# EAGLE schematic lightmeter_proto3 (EAGLE 7.1.0)
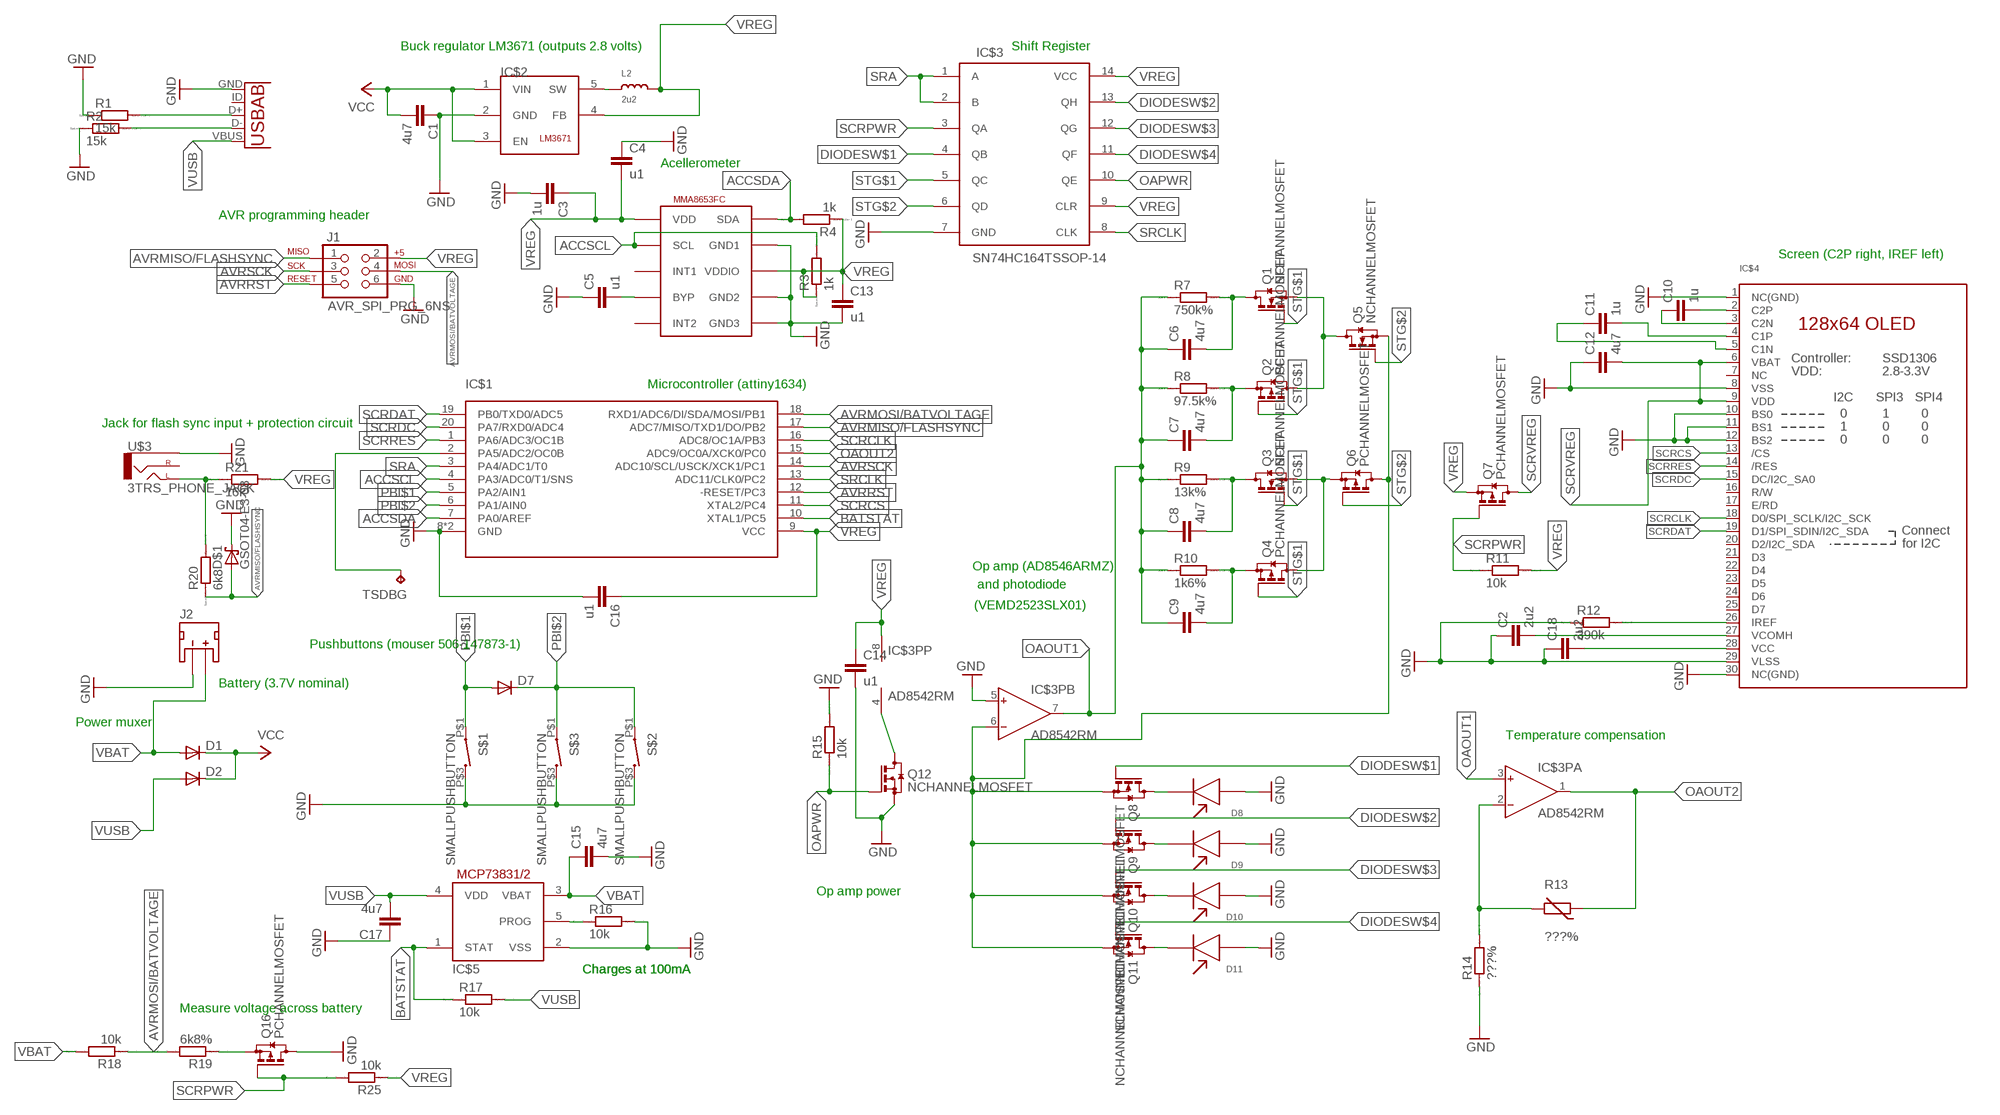
[diagram p0: schematic, sheet 1]

## Parts
C1  4u7  C-EUC0402  [C0402]
C2  2u2  C-EUC0402  [C0402]
C3  1u  C-EUC0402  [C0402]
C4  u1  C-EUC0402  [C0402]
C5  u1  C-EUC0402  [C0402]
C6  4u7  C-EUC0402  [C0402]
C7  4u7  C-EUC0402  [C0402]
C8  4u7  C-EUC0402  [C0402]
C9  4u7  C-EUC0402  [C0402]
C10  1u  C-EUC0402  [C0402]
C11  1u  C-EUC0402  [C0402]
C12  4u7  C-EUC0402  [C0402]
C13  u1  C-EUC0402  [C0402]
C14  u1  C-EUC0402  [C0402]
C15  4u7  C-EUC0402  [C0402]
C16  u1  C-EUC0402  [C0402]
C17  4u7  C-EUC0402  [C0402]
C18  2u2  C-EUC0402  [C0402]
D1  DIODE-SOD323-W  [SOD323-W]
D2  DIODE-SOD323-W  [SOD323-W]
D7  DIODE-SOD323-W  [SOD323-W]
D8  VEMD2523SLX01  [VEMD2523SLX01]
D9  VEMD2523SLX01  [VEMD2523SLX01]
D10  VEMD2523SLX01  [VEMD2523SLX01]
D11  VEMD2523SLX01  [VEMD2523SLX01]
D$1  GSOT04-E3-08  [SOT23]
IC$1  ATTINY1634MLF20  [MLF20]
IC$2  LM3671  [SOT23-5]
IC$3  SN74HC164TSSOP-14  [TSSOP14]
IC$3P  AD8542RM  [MSOP08]
IC$4  DISP_OLED_UG-2864HSWEG010.96"  [UG-2864HSWEG01_0.96IN_WRAPAROUND]
IC$5  MCP73831/OT  [SOT23-5L]
IC$6  MMA8653  [DFN-10]
J1  AVR_SPI_PRG_6NS  [2X3-NS]
J2  JST_2MM_MALE  [JST-2-SMD]
L2  2u2  INDUCTOR_0603  [_0603]
Q1  NCHANNELMOSFET  [SOT-416-3]
Q2  PCHANNELMOSFET  [SOT-416-3]
Q3  NCHANNELMOSFET  [SOT-416-3]
Q4  PCHANNELMOSFET  [SOT-416-3]
Q5  NCHANNELMOSFET  [SOT-416-3]
Q6  PCHANNELMOSFET  [SOT-416-3]
Q7  PCHANNELMOSFET  [SOT-416-3]
Q8  NCHANNELMOSFET  [SOT-416-3]
Q9  NCHANNELMOSFET  [SOT-416-3]
Q10  NCHANNELMOSFET  [SOT-416-3]
Q11  NCHANNELMOSFET  [SOT-416-3]
Q12  NCHANNELMOSFET  [SOT-416-3]
Q16  PCHANNELMOSFET  [SOT-416-3]
R1  15k  R-EU_R0402  [R0402]
R2  15k  R-EU_R0402  [R0402]
R3  1k  R-EU_R0402  [R0402]
R4  1k  R-EU_R0402  [R0402]
R7  750k%  R-EU_R0402  [R0402]
R8  97.5k%  R-EU_R0402  [R0402]
R9  13k%  R-EU_R0402  [R0402]
R10  1k6%  R-EU_R0402  [R0402]
R11  10k  R-EU_R0402  [R0402]
R12  390k  R-EU_R0402  [R0402]
R13  ???%  THERMISTORR0402  [R0402]
R14  ???%  R-EU_R0402  [R0402]
R15  10k  R-EU_R0402  [R0402]
R16  10k  R-EU_R0402  [R0402]
R17  10k  R-EU_R0402  [R0402]
R18  10k  R-EU_R0402  [R0402]
R19  6k8%  R-EU_R0402  [R0402]
R20  6k8  R-EU_R0402  [R0402]
R21  16k  R-EU_R0402  [R0402]
R25  10k  R-EU_R0402  [R0402]
S$1  SMALLPUSHBUTTON  [BUTTON]
S$2  SMALLPUSHBUTTON  [BUTTON]
S$3  SMALLPUSHBUTTON  [BUTTON]
TSDBG  TPPAD1-13  [P1-13]
U1  USB-AB  [USB-AB-MICRO]
U$3  3TRS_PHONE_JACK  [3TRS-SMD]

## Nets
ACCSCL: IC$1.4(PA3/ADC0/T1/SNS) IC$6.P$2(SCL) R3.2
ACCSDA: IC$1.7(PA0/AREF) IC$6.P$10(SDA) R4.2
AVRMISO/FLASHSYNC: D$1.1(A) IC$1.17(ADC7/MISO/TXD1/DO/PB2) J1.1 R20.1
AVRMOSI/BATVOLTAGE: IC$1.18(RXD1/ADC6/DI/SDA/MOSI/PB1) J1.4 R18.1 R19.2
AVRRST: IC$1.12(-RESET/PC3) J1.5
AVRSCK: IC$1.14(ADC10/SCL/USCK/XCK1/PC1) J1.3
BATSTAT: IC$1.10(XTAL1/PC5) IC$5.1(STAT) R17.1
DIODESW$1: IC$3.4(QB) Q8.P$1(G)
DIODESW$2: IC$3.13(QH) Q9.P$1(G)
DIODESW$3: IC$3.12(QG) Q10.P$1(G)
DIODESW$4: IC$3.11(QF) Q11.P$1(G)
GND: C1.1 C2.1 C3.2 C4.1 C5.1 C12.1 C13.2 C14.2 C15.2 C16.2 C17.1 C18.1 D8.P$1 D9.P$1 D10.P$1 D11.P$1 D$1.3(C) IC$1.8(GND) IC$1.GND IC$2.2(GND) IC$3.7(GND) IC$3P.5(B:IN+) IC$4.1(NC(GND)) IC$4.8(VSS) IC$4.10(BS0) IC$4.11(BS1) IC$4.12(BS2) IC$4.29(VLSS) IC$4.30(NC(GND)) IC$5.2(VSS) IC$6.P$6(GND3) IC$6.P$7(GND2) IC$6.P$9(GND1) J1.6 J2.1(-) Q12.P$2(S) Q16.P$3(D) R1.1 R2.1 R12.1 R14.1 R15.2 R16.2 S$1.P$3 S$2.P$3 S$3.P$3 U1.GND U$3.P$1(SLEEVE)
N$1: D8.P$2 Q8.P$3(D)
N$2: D9.P$2 Q9.P$3(D)
N$3: C7.2 Q2.P$2(S) R8.2
N$4: C9.2 Q4.P$2(S) R10.2
N$5: IC$5.5(PROG) R16.1
N$6: IC$3P.4(P:V-) Q12.P$3(D)
N$7: C5.2 IC$6.P$4(BYP)
N$9: D10.P$2 Q10.P$3(D)
N$10: IC$2.5(SW) L2.1
N$11: D11.P$2 Q11.P$3(D)
N$12: C2.2 IC$4.27(VCOMH)
N$14: C8.2 Q3.P$3(D) R9.2
N$15: C10.2 IC$4.2(C2P)
N$16: C10.1 IC$4.3(C2N)
N$17: Q16.P$2(S) R19.1
N$19: IC$4.26(IREF) R12.2
N$20: Q1.P$2(S) Q2.P$3(D) Q5.P$3(D)
N$21: C6.2 Q1.P$3(D) R7.2
N$22: Q3.P$2(S) Q4.P$3(D) Q6.P$2(S)
N$23: IC$1.2(PA5/ADC2/OC0B) TSDBG.TP
N$24: C11.1 IC$4.5(C1N)
N$26: IC$3P.6(B:IN-) Q5.P$2(S) Q6.P$3(D) Q8.P$2(S) Q9.P$2(S) Q10.P$2(S) Q11.P$2(S)
N$27: C11.2 IC$4.4(C1P)
N$28: R1.2 U1.D+
N$29: R20.2 R21.1 U$3.P$3(LEFT)
N$30: C18.2 IC$4.28(VCC)
N$31: IC$3P.2(A:IN-) R13.2 R14.2
N$32: R2.2 U1.D-
OAOUT1: C6.1 C7.1 C8.1 C9.1 IC$3P.3(A:IN+) IC$3P.7(B:OUT) R7.1 R8.1 R9.1 R10.1
OAOUT2: IC$1.15(ADC9/OC0A/XCK0/PC0) IC$3P.1(A:OUT) R13.1
OAPWR: IC$3.10(QE) Q12.P$1(G) R15.1
PBI$1: D7.A IC$1.5(PA2/AIN1) S$1.P$1
PBI$2: D7.C IC$1.6(PA1/AIN0) S$2.P$1 S$3.P$1
SCRCLK: IC$1.16(ADC8/OC1A/PB3) IC$4.18(D0/SPI_SCLK/I2C_SCK)
SCRCS: IC$1.11(XTAL2/PC4) IC$4.13(/CS)
SCRDAT: IC$1.19(PB0/TXD0/ADC5) IC$4.19(D1/SPI_SDIN/I2C_SDA)
SCRDC: IC$1.20(PA7/RXD0/ADC4) IC$4.15(DC/I2C_SA0)
SCRPWR: IC$3.3(QA) Q7.P$1(G) Q16.P$1(G) R11.1 R25.2
SCRRES: IC$1.1(PA6/ADC3/OC1B) IC$4.14(/RES)
SCRVREG: C12.2 IC$4.6(VBAT) IC$4.9(VDD) Q7.P$3(D)
SRA: IC$1.3(PA4/ADC1/T0) IC$3.1(A) IC$3.2(B)
SRCLK: IC$1.13(ADC11/CLK0/PC2) IC$3.8(CLK)
STG$1: IC$3.5(QC) Q1.P$1(G) Q2.P$1(G) Q3.P$1(G) Q4.P$1(G)
STG$2: IC$3.6(QD) Q5.P$1(G) Q6.P$1(G)
VBAT: C15.1 D1.A IC$5.3(VBAT) J2.2(+) R18.2
VCC: C1.2 D1.C D2.C IC$2.1(VIN) IC$2.3(EN)
VREG: C3.1 C4.2 C13.1 C14.1 C16.1 IC$1.9(VCC) IC$2.4(FB) IC$3.9(CLR) IC$3.14(VCC) IC$3P.8(P:V+) IC$6.P$1(VDD) IC$6.P$8(VDDIO) J1.2 L2.2 Q7.P$2(S) R3.1 R4.1 R11.2 R21.2 R25.1
VUSB: C17.2 D2.A IC$5.4(VDD) R17.2 U1.VBUS
Unconnected: IC$4.7(NC) IC$4.16(R/W) IC$4.17(E/RD) IC$4.20(D2/I2C_SDA) IC$4.21(D3) IC$4.22(D4) IC$4.23(D5) IC$4.24(D6) IC$4.25(D7) IC$6.P$3(INT1) IC$6.P$5(INT2) J2.NC1(PAD1) J2.NC2(PAD2) U1.ID(USBID) U$3.P$2(RIGHT)

## Notes on the sheet
- Buck regulator LM3671 (outputs 2.8 volts) | Shift Register
- Acellerometer
- AVR programming header
- Screen (C2P right, IREF left)
- Microcontroller (attiny1634)
- Jack for flash sync input + protection circuit
- Op amp (AD8546ARMZ)
- and photodiode
- (VEMD2523SLX01)
- Pushbuttons (mouser 506-147873-1)
- Battery (3.7V nominal)
- Power muxer
- Temperature compensation
- Op amp power
- Charges at 100mA | Charges at 100mA
- Measure voltage across battery

## Library data of the parts
C1-C18 = rcl:C-EU: CAPACITOR, European symbol
D1 D2 D7 = diode2:DIODE-: DIODE
D8-D11 = lightmeter:VEMD2523SLX01
D$1 = lightmeter:GSOT04-E3-08
IC$1 = attiny1634_corrected:ATTINY1634
IC$2 = lightmeter:LM3671
IC$3 = lightmeter:SN74HC164
IC$3P = analog-devices:AD8542: General-Purpose CMOS Rail-to-Rail Amplifiers Source: http://www.analog.com/static/imported-files/data_sheets/AD8541_8542_8544.pdf; MPN: AD8542ARZ; OC_FARNELL: 1464965; OC_NEWARK: 19M0965
IC$4 = microbuilder:DISP_OLED_UG-2864HSWEG01: UG-2864HSWEG01 OLED display Both 1.3" and 0.96" models share the same FPC tab footprint, only the screen dimensions vary.
IC$5 = adafruit:MCP73831: MCP73831/2 Miniature Single-Cell, Fully Integrated Li-Ion, Li-Polymer Charge Management Controllers. Nice and small simple lipoly charge controller, with adjustable current and status output (LED) http://www.ladyada.net/library/pcb/eaglelibrary.html
IC$6 = lightmeter:MMA8653
J1 = SparkFun-Connectors:AVR_SPI_PRG_6: AVR ISP 6 Pin This is the reduced ISP connector for AVR programming. Common on Arduino. This footprint will take up less PCB space and can be used with a 10-pin to 6-pin adapter such as SKU: BOB-08508 **Special note about "TEST_POINT" package. The stop mask is on the top side, so if you want your programming test points to be on the bottom of your board, make sure to place this package on the bottom side of the board. This also ensure that the orientation to program from the bottom side will be correct.
J2 = SparkFun-Connectors:JST_2MM_MALE: Mates to single-cell LiPo batteries. CONN-08352; PROD_ID: CONN-08352
L2 = microbuilder:INDUCTOR: Inductors 0603: 10nH Ceramic Inductor - microwire antenna/RF (Digikey: 712-1434-2-ND) 0805: 560nH Ceramic Inductor - RF (Digikey: 553-1047-1-ND) 270nH Ceramic Inductor - Q = 40@250MHz, +-5%, 1 Ohm DC Resistance (Digikey: 535-10506-2-ND) 1007 (2518 Metric) SMT: 10µH 10% 250mOhm 820mA 1007 Inductor (Digikey: 587-2189-1-ND) 22µH 10% 500mOhm 580mA 1007 Inductor (Digikey: 587-2190-1-ND) 47µH 10% 950mOhm 420mA 1007 Inductor (Digikey: 587-2191-1-ND) 47µH 5% 100mOhm 1A 1008 Inductor (Digikey: 732-1816-1-ND) 5.0x5.0mm (Taiyo Yuden NR5040 Series) 6.8µH 20% 2.3A 64mOhm Inductor (Digikey: 587-2374-2-ND) 5.0x5.0mm (TDK VLC5045 Series) 4.7µH 20% 3.3A 34mOhm Inductor (Digikey: 445-6526-1-ND) 6.8µH 20% 2.7A 46mOhm Inductor (Digikey: 445-6527-1-ND) 6.0x6.0mm (TDK VLC6045 Series) 4.7µH 20% 3.8A 27mOhm Inductor (Digikey: 445-6538-2-ND) 6.8µH 20% 3A 41mOhm Inductor (Digikey: 445-6540-1-ND) 6.2µH 30% 2.2A 45mOhm Inductor (Digikey: SRR5028-6R2YCT-ND) - Not TDK VLC6045 but footprint should match 6.0x6.0mm (TDK SLF6045 Series) 6.8uH 30% 2A 33mOhm Inductor (Digikey: 445-4572-1-ND, Mouser: 810-SLF645T6R8N2R0PF)
Q1 Q3 Q5 Q8-Q12 = lightmeter:NCHANNELMOSFET
Q2 Q4 Q6 Q7 Q16 = lightmeter:PCHANNELMOSFET
R1-R4 R7-R12 R14-R21 R25 = resistor:R-EU_: RESISTOR, European symbol; SPICEPREFIX: R
R13 = lightmeter:THERMISTOR: THERMISTOR
S$1-S$3 = lightmeter:SMALLPUSHBUTTON
TSDBG = testpad:TP: Test pad
U1 = lightmeter:USB-AB: This is a USB AB connector that is compatible with USB OTG. i.e. this connector can serve as a host or device
U$3 = lightmeter:3TRS_PHONE_JACK